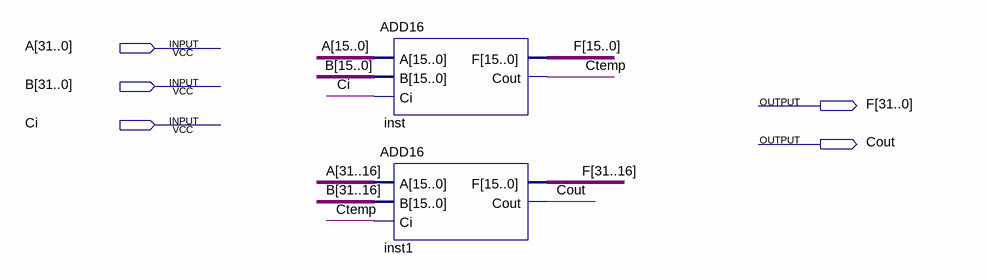
[diagram p0: schematic sheet]
// Quartus schematic ADD32.bdf as structural Verilog: 2 symbols, 5 pins
module ADD32 (
  input  [31:0] A,
  input  [31:0] B,
  input  Ci,
  output [31:0] F,
  output Cout
);

  wire Ctemp;

  ADD16 inst (.A(A[15:0]), .B(B[15:0]), .Ci(Ci), .F(F[15:0]), .Cout(Ctemp));
  ADD16 inst1 (.A(A[31:16]), .B(B[31:16]), .Ci(Ctemp), .F(F[31:16]), .Cout(Cout));
endmodule
